# EAGLE design linistepper with aligned transistors_my_version4_powerfix (EAGLE 7.6.0)
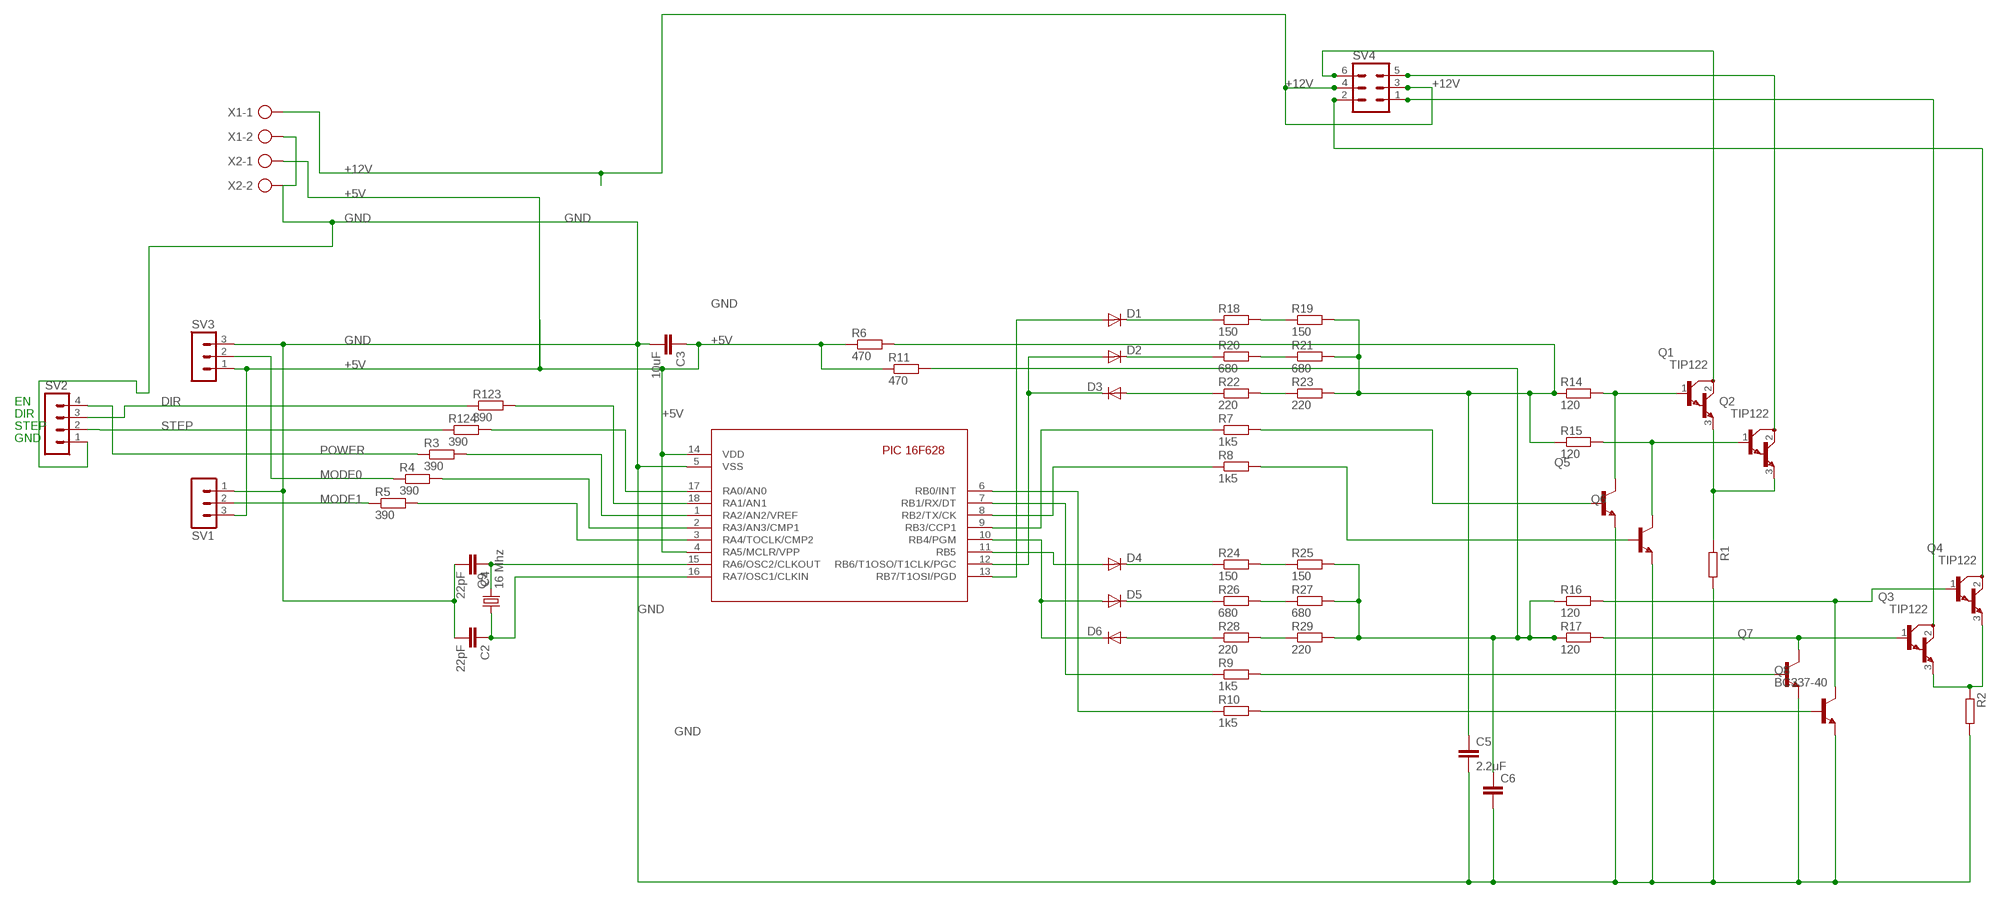
[diagram p0: schematic, sheet 1]

## Parts
C2  22pF  C-EU025-024X044  [C025-024X044]
C3  10uF  C-EU025-040X050  [C025-040X050]
C4  22pF  C-EU025-024X044  [C025-024X044]
C5  2.2uF  C-EU050-024X044  [C050-024X044]
C6  C-EU050-024X044  [C050-024X044]
D1  1N4148  [DO35-10]
D2  1N4148  [DO35-10]
D3  1N4148  [DO35-10]
D4  1N4148  [DO35-10]
D5  1N4148  [DO35-10]
D6  1N4148  [DO35-10]
Q1  TIP122  [TO220]
Q2  TIP122  [TO220]
Q3  TIP122  [TO220]
Q4  TIP122  [TO220]
Q5  BC337-40  [TO92]
Q6  BC337-40  [TO92]
Q7  BC337-40  [TO92]
Q8  BC337-40  [TO92]
Q9  16 Mhz  CRYTALHC49S  [HC49/S]
R1  R-EU_0922/22  [0922/22]
R2  R-EU_0922/22  [0922/22]
R3  390  R-EU_0207/2V  [0207/2V]
R4  390  R-EU_0411/3V  [0411V]
R5  390  R-EU_0207/5V  [0207/5V]
R6  470  R-EU_0207/10  [0207/10]
R7  1k5  R-EU_0207/10  [0207/10]
R8  1k5  R-EU_0207/7  [0207/7]
R9  1k5  R-EU_0207/5V  [0207/5V]
R10  1k5  R-EU_0207/5V  [0207/5V]
R11  470  R-EU_0207/7  [0207/7]
R14  120  R-EU_0207/10  [0207/10]
R15  120  R-EU_0207/7  [0207/7]
R16  120  R-EU_0207/5V  [0207/5V]
R17  120  R-EU_0207/5V  [0207/5V]
R18  150  R-EU_0207/2V  [0207/2V]
R19  150  R-EU_0207/2V  [0207/2V]
R20  680  R-EU_0207/2V  [0207/2V]
R21  680  R-EU_0207/2V  [0207/2V]
R22  220  R-EU_0207/2V  [0207/2V]
R23  220  R-EU_0207/2V  [0207/2V]
R24  150  R-EU_0207/2V  [0207/2V]
R25  150  R-EU_0207/2V  [0207/2V]
R26  680  R-EU_0207/2V  [0207/2V]
R27  680  R-EU_0207/2V  [0207/2V]
R28  220  R-EU_0207/2V  [0207/2V]
R29  220  R-EU_0207/2V  [0207/2V]
R123  390  R-EU_0207/2V  [0207/2V]
R124  390  R-EU_0207/2V  [0207/2V]
SV1  MA03-1  [MA03-1]
SV2  MA04-1  [MA04-1]
SV3  MA03-1  [MA03-1]
SV4  MA03-2  [MA03-2]
U$1  16F628  [PIC16F628-18-LEAD-PDIP]
X1  AK300/2  [AK300/2]
X2  AK300/2  [AK300/2]

## Nets
+5V: C3.1 R6.1 R11.1 SV1.3 SV3.1 U$1.4(RA5/MCLR/VPP) U$1.14(VDD) X2.1
+12V: SV4.3 SV4.4 X1.1
DIR: R123.1 SV2.3
GND: C2.2 C3.2 C4.2 C5.2 C6.2 Q5.1(E) Q6.1(E) Q7.1(E) Q8.1(E) R1.2 R2.2 SV1.1 SV2.1 SV3.3 U$1.5(VSS) X1.2 X2.2
MODE0: R4.1 SV3.2
MODE1: R5.1 SV1.2
N$1: R18.2 R19.1
N$2: C5.1 R6.2 R14.1 R15.1 R19.2 R21.2 R23.2
N$3: R20.2 R21.1
N$5: Q1.1(B) Q5.3(C) R14.2
N$6: Q2.1(B) Q6.3(C) R15.2
N$7: D1.C R18.1
N$8: D2.C R20.1
N$9: D3.A R22.1
N$10: D1.A U$1.13(RB7/T1OSI/PGD)
N$11: D2.A D3.C U$1.12(RB6/T1OSO/T1CLK/PGC)
N$12: R8.1 U$1.8(RB2/TX/CK)
N$13: R7.1 U$1.9(RB3/CCP1)
N$14: Q5.2(B) R7.2
N$15: Q6.2(B) R8.2
N$16: Q1.3(E) Q2.3(E) R1.1
N$17: R3.2 U$1.1(RA2/AN2/VREF)
N$18: R4.2 U$1.2(RA3/AN3/CMP1)
N$19: R24.2 R25.1
N$20: D5.C R26.1
N$21: R26.2 R27.1
N$22: D6.A R28.1
N$23: R28.2 R29.1
N$24: D4.A U$1.11(RB5)
N$25: D5.A D6.C U$1.10(RB4/PGM)
N$26: R9.1 U$1.7(RB1/RX/DT)
N$27: R10.1 U$1.6(RB0/INT)
N$28: C6.1 R11.2 R16.1 R17.1 R25.2 R27.2 R29.2
N$29: Q4.1(B) Q8.3(C) R16.2
N$30: Q8.2(B) R10.2
N$31: Q3.1(B) Q7.3(C) R17.2
N$32: Q7.2(B) R9.2
N$33: Q3.3(E) Q4.3(E) R2.1
N$34: Q1.2(C) SV4.6
N$35: Q2.2(C) SV4.5
N$36: Q3.2(C) SV4.1
N$37: Q4.2(C) SV4.2
N$39: R124.2 U$1.17(RA0/AN0)
N$41: R123.2 U$1.18(RA1/AN1)
N$43: C2.1 Q9.1 U$1.16(RA7/OSC1/CLKIN)
N$44: C4.1 Q9.2 U$1.15(RA6/OSC2/CLKOUT)
N$48: R5.2 U$1.3(RA4/TOCLK/CMP2)
POWER: R3.1 SV2.4
R23: R22.2 R23.1
R24: D4.C R24.1
STEP: R124.1 SV2.2

## Notes on the sheet
- EN
- DIR
- STEP
- GND

## Library data of the parts
C2-C6 = rcl:C-EU: CAPACITOR, European symbol
D1-D6 = diode:1N4148: DIODE high speed (Philips)
Q1-Q4 = transistor-npn_no_hole:TIP122*: NPN Darlington Transistor
Q5-Q8 = transistor-npn:BC337*: NPN Transistor
Q9 = crystal:CRYTAL: CRYSTAL
R1 R2 R5-R7 R14 R18-R29 R123 R124 = rcl:R-EU_: RESISTOR, European symbol
R3 R4 R8-R11 R15-R17 = resistor:R-EU_: RESISTOR, European symbol
SV1 SV3 = con-lstb:MA03-1: PIN HEADER
SV2 = con-lstb:MA04-1: PIN HEADER; OC_FARNELL: unknown; OC_NEWARK: unknown
SV4 = con-lstb:MA03-2: PIN HEADER
U$1 = pic16f6xx:16F628: Microchip component PIC 16F628 Eric Magraner - eric_magraner@yahoo.fr 03/2004
X1 X2 = con-ptr500:AK300/2: CONNECTOR; OC_FARNELL: unknown; OC_NEWARK: unknown

## Board
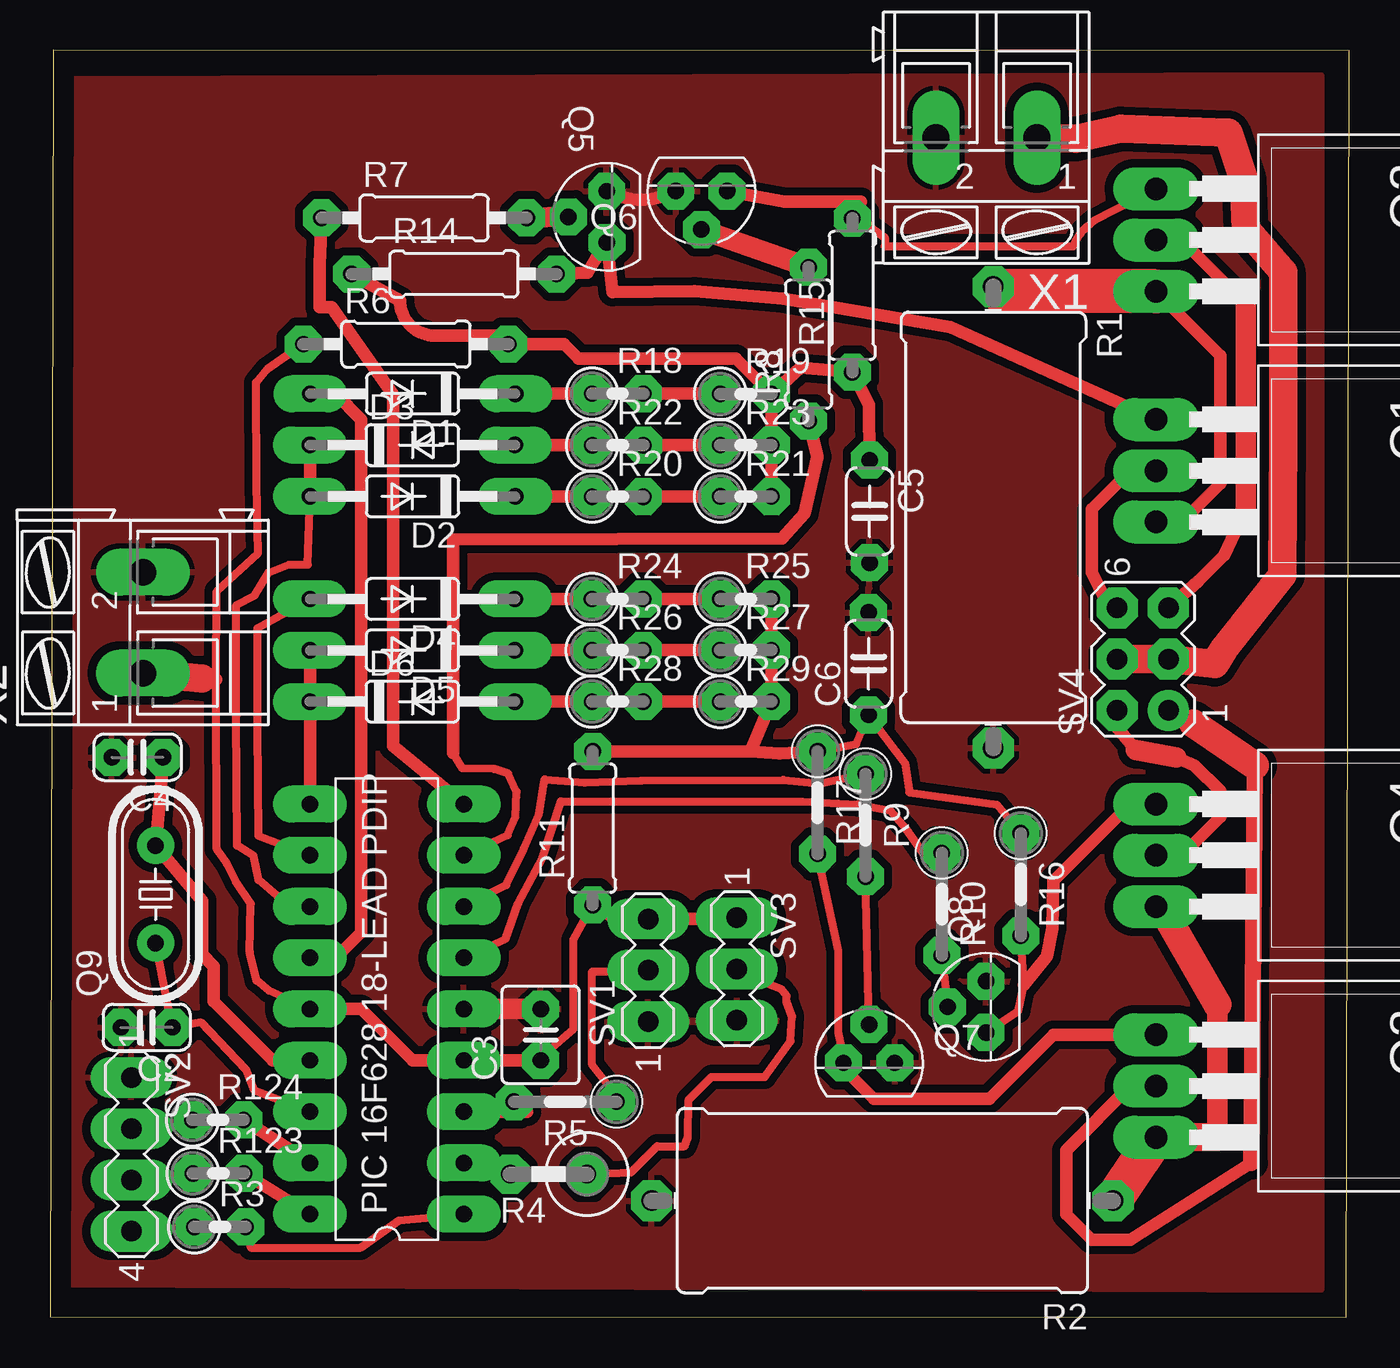
[diagram p1: board, top side]

Size 64.33 x 62.74 mm. Coordinates in mm from the lower left corner, seen from the top.
Outline: 0,0.02 64.19,0 64.33,62.72 0.14,62.74 0,0.02
Copper layers (1*16): Top 0.035mm / dielectric 1.5mm / Bottom 0.035mm
Design rules "default *": minimum track width 24mil, minimum drill 24mil, track to track 16mil, track to pad 15mil, pad to pad 8mil, via to via 8mil, smd to smd 8mil, copper to edge 40mil, drill to drill 8mil, minimum pad ring 20mil, minimum via ring 8mil, stop-mask expansion 4mil, vias tented up to drill 0mil, thermal gap 10mil

### Footprints (pad centres in the part's own frame; a part is rotated, then mirrored left to right if it is on the bottom)
C025-024X044 = drill 0.813 octagon: 1 -1.27,0; 2 1.27,0
C025-040X050 = drill 0.813 octagon: 1 -1.27,0; 2 1.27,0
C050-024X044 = drill 0.813 octagon: 1 -2.54,0; 2 2.54,0
DO35-10 = drill 0.813 long: A 5.08,0; C -5.08,0
TO220 = drill 1.118 long: 1 -2.54,-6.35; 2 0,-6.35; 3 2.54,-6.35
TO92 = drill 0.813 octagon: 1 1.27,0; 2 0,1.905; 3 -1.27,0
HC49/S = drill 0.813: 1 -2.413,0; 2 2.413,0
0922/22 = drill 1.016 octagon: 1 -11.43,0; 2 11.43,0
0207/2V = drill 0.813 octagon: 1 -1.27,0; 2 1.27,0
0411V = drill 0.914 octagon: 1 -2.54,0; 2 1.27,0
0207/5V = drill 0.813 octagon: 1 -2.54,0; 2 2.54,0
0207/10 = drill 0.813 octagon: 1 -5.08,0; 2 5.08,0
0207/7 = drill 0.813 octagon: 1 -3.81,0; 2 3.81,0
MA03-1 = drill 1.016 long: 1 -2.54,0; 2 0,0; 3 2.54,0
MA04-1 = drill 1.016 long: 1 -3.81,0; 2 -1.27,0; 3 1.27,0; 4 3.81,0
MA03-2 = drill 1.016: 1 -2.54,-1.27 | drill 1.016 octagon: 2 -2.54,1.27; 3 0,-1.27; 4 0,1.27; 5 2.54,-1.27; 6 2.54,1.27
PIC16F628-18-LEAD-PDIP = drill 0.813 long: 1 -10.16,-3.81; 2 -7.62,-3.81; 3 -5.08,-3.81; 4 -2.54,-3.81; 5 0,-3.81; 6 2.54,-3.81; 7 5.08,-3.81; 8 7.62,-3.81; 9 10.16,-3.81; 10 10.16,3.81; 11 7.62,3.81; 12 5.08,3.81; 13 2.54,3.81; 14 0,3.81; 15 -2.54,3.81; 16 -5.08,3.81; 17 -7.62,3.81; 18 -10.16,3.81
AK300/2 = drill 1.321 long: 1 -2.515,0; 2 2.489,0

### Placement (x,y rotation side)
C2  4.76,14.35 180 top
C3  24.28,13.98 90 top
C4  4.31,27.73 180 top
C5  40.58,39.91 270 top
C6  40.53,32.37 90 top
D1  17.94,45.73 180 top
D2  17.94,40.65 180 top
D3  17.93,43.2 0 top
D4  17.93,35.57 180 top
D5  17.93,33.02 180 top
D6  17.93,30.49 0 top
Q1  61.11,41.92 270 top
Q2  61.11,53.35 270 top
Q3  61.11,11.44 270 top
Q4  61.11,22.87 270 top
Q5  27.56,54.5 90.1 top
Q6  32.25,55.78 180 top
Q7  40.55,12.59 0 top
Q8  46.34,15.37 90 top
Q9  5.21,20.94 90 top
R1  46.71,39.62 270 top
R2  41.21,5.77 180 top
R3  8.4,4.46 0 top
R4  24.04,7.08 180 top
R5  25.5,10.66 180 top
R6  17.61,48.2 0 top
R7  18.51,54.45 0 top
R8  37.56,48.2 90 top
R9  40.37,24.36 270 top
R10  44.15,20.45 270 top
R11  26.86,24.22 90 top
R14  19.99,51.67 0 top
R15  39.72,50.61 90 top
R16  48.06,21.42 270 top
R17  38,25.48 270 top
R18  28.1,45.75 0 top
R19  34.44,45.73 0 top
R20  28.1,40.64 0 top
R21  34.45,40.65 0 top
R22  28.1,43.19 0 top
R23  34.44,43.2 0 top
R24  28.09,35.57 0 top
R25  34.45,35.58 0 top
R26  28.09,33.03 0 top
R27  34.44,33.04 0 top
R28  28.1,30.49 0 top
R29  34.45,30.49 0 top
R123  8.32,7.11 0 top
R124  8.3,9.76 0 top
SV1  29.61,17.17 90 top
SV2  4.01,8.06 270 top
SV3  34.01,17.24 270 top
SV4  54.12,32.59 90 top
U$1  16.66,15.25 90 top
X1  46.35,58.42 180 top
X2  4.58,34.41 90 top

### Tracks (layer width: path | path; a pad name or v marks a point on that pad's centre or on a via)
+5V
  Top 0.406: 24.48,12.71 24.48,13.03 25.91,14.27 25.91,18.7 R11.1 | R6.1 10.72,46.93 10.19,46.3 10.21,41.23 10.29,37.84 8.25,35.96 8.2,31.58 8.25,23.17 8.75,22.45 9.2,21.55 9.93,20.48 9.87,18.07 10.21,16.67 10.82,16.17 U$1.14
  Top 0.61: U$1.14 15.39,15.25 17.93,12.71 U$1.4 C3.1 24.48,12.71 | R11.1 28.09,19.66 SV1.3 34.2,19.71 SV3.1 | 7.5,31.64 8.2,31.58
  Top 1.422: X2.1 7.5,31.64
+12V
  Top 1.422: X1.1 50.79,58.37 53.02,58.86 58.35,58.66 59.12,56.33 59.22,53.91 61.07,51.77 61.07,43.57 61.03,36.77 58.15,33.13 57.67,32.35 SV4.3 SV4.4
DIR
  Top 0.406: SV2.3 R123.1
GND
  Top 0.61: Q5.1 arc56 Q6.1
  Top 1.016: C3.2 U$1.5
  pour Top (isolate 0.406): 0.64,61.33 62.95,61.54 62.95,1.33 0.54,1.59
MODE0
  Top 0.406: R4.1 28.75,7.17 30.05,8.46 31.41,8.46 31.58,8.92 31.61,10.76 32.74,11.89 35.38,11.89 36.67,13.68 36.74,14.89 36.47,15.63 36.47,15.9 36.2,16.25 34.25,16.99 SV3.2
MODE1
  Top 0.406: R5.1 27.67,11.42 26.83,12.49 26.83,17.12 27.16,17.12 27.77,17.12 27.95,17.3 29.48,17.3 SV1.2
N$1
  Top 0.254: R19.1
  Top 0.61: R19.1 R18.2
N$2
  Top 0.61: R14.1 17.31,50.35 arc90 19.05,48.61 22.54,48.61 arc90 R6.2 25.44,48.2 26.16,47.48 33.96,47.48 R19.2 | R19.2 37.15,47.04 R15.1 40.56,45.21 C5.1 | R19.2 R23.2 R21.2
N$3
  Top 0.254: R21.1
  Top 0.61: R20.2 R21.1
N$4
  Top 0.406: 48.36,18.8 48.36,18.87
N$5
  Top 0.61: R14.2 26.61,51.75 27.01,52.41 Q5.3 27.85,50.77 31.9,50.81 36.28,50.44 44.58,49.03 Q1.1
N$6
  Top 0.406: 40.41,54.14 41.33,53.47 41.33,53.04 50.67,53.04 arc-33 51.72,54.33 Q2.1
  Top 0.61: Q6.3 36.35,55.26 40.16,55.26 R15.2 40.41,54.14
N$7
  Top 0.61: D1.C 24.28,45.73 25.55,45.73 R18.1
N$8
  Top 0.61: D2.C 24.28,40.65 25.55,40.65 R20.1
N$9
  Top 0.61: R22.1 25.55,43.19 24.28,43.19 D3.A
N$10
  Top 0.61: U$1.13 14.12,17.79 15.39,19.06 15.39,44.46 14.12,45.73 D1.A
N$11
  Top 0.254: D2.A
  Top 0.406: U$1.12 11.22,20.86 10.31,21.64 10.05,22.84 9.24,23.36 9.21,29.82 9.21,35.26 10.12,35.75 10.8,36.88 11.8,37.27 12.74,37.27 D2.A
  Top 0.61: D2.A 12.85,41.92 D3.C
N$12
  Top 0.406: U$1.8 22.64,23.87 23.03,24.78 23.1,26.01 22.68,26.92 22,27.15 20.41,27.18 19.94,27.95
  Top 0.61: R8.1 38,42.62 37.35,39.81 36.25,38.57 19.94,38.52 19.94,27.95
N$13
  Top 0.61: U$1.9 16.97,28.28 16.97,45.71 13.93,50.04 13.32,50.04 13.32,52.15 R7.1
N$14
  Top 1.016: R7.2 Q5.2
N$15
  Top 1.016: R8.2 Q6.2
N$16
  Top 0.61: 47.14,50.81 R1.1 | Q1.3 56.03,39.38 57.94,41.29 57.94,47.64 Q2.3
  Top 2.184: Q2.3 47.14,50.81
N$17
  Top 0.406: R3.2 9.92,3.43 15.36,3.43 17.27,4.78 U$1.1
N$18
  Top 0.61: U$1.2 21.75,7.63 R4.2
N$19
  Top 0.254: R25.1
  Top 0.61: R24.2 R25.1
N$20
  Top 0.61: D5.C 24.28,33.03 25.55,33.03 R26.1
N$21
  Top 0.254: R27.1
  Top 0.61: R26.2 R27.1
N$22
  Top 0.61: D6.A 24.28,30.49 25.55,30.49 R28.1
N$23
  Top 0.254: R29.1
  Top 0.61: R28.2 R29.1
N$24
  Top 0.406: U$1.11 10.3,23.84 10.25,29.12 10.25,34.12 D4.A
N$25
  Top 0.254: D5.A | D6.C
  Top 0.61: U$1.10 D6.C D5.A
N$26
  Top 0.406: U$1.7 22.58,21.41 23.46,23.23 24.2,24.9 24.48,26.63 26.47,26.48 29.26,26.58 36.31,26.62 38.1,26.43 R9.1
N$27
  Top 0.406: U$1.6 22.55,18.74 23.17,20.49 24.37,22.76 25.29,25.55 37.24,25.54 40,25.4 41.58,25.1 42.39,24.18 43.22,23 R10.1
N$28
  Top 0.254: R25.2 | R29.2
  Top 0.406: R17.1 39.92,28.38 C6.1 42.32,27.46 42.54,26 46.87,25.39 R16.1
  Top 0.61: R25.2 R27.2 R29.2 34.68,28.03 | R11.2 34.68,28.03 | 34.68,28.03 36.11,27.91 R17.1
N$29
  Top 0.406: Q8.3 47.94,15.15 48.21,16.46 R16.2
  Top 0.61: Q4.1 53.49,25.41 49.68,21.6 49.63,19.25 49.37,17.87 48.21,16.46
N$30
  Top 0.406: R10.2 Q8.2
N$31
  Top 0.406: Q7.3 39.21,13.29 39.03,14.1 39.03,18.15 R17.2
  Top 0.61: Q3.1 49.68,13.98 46.51,10.81 40.79,10.81 39.52,12.08 Q7.3
N$32
  Top 0.406: Q7.2 R9.2
N$33
  Top 1.016: 57.81,8.93 57.81,15.49
  Top 1.422: Q3.3 57.81,8.93 | 57.81,15.49 55.23,19.98 Q4.3
  Top 1.93: R2.1 Q3.3
N$34
  Top 0.61: Q1.2 53.49,41.92 51.59,40.02 51.59,38.75 51.59,36.88 52.26,35.54 SV4.6
N$35
  Top 0.61: 59.21,40.02 58.15,37.75 56.85,36.45 SV4.5 | 59.21,50.18 56.03,53.35 Q2.2
  Top 1.016: 59.21,50.18 59.21,40.02
N$36
  Top 0.61: 59.49,7.63 53.49,3.82 51.59,3.82 50.32,5.09 50.32,8.27 53.49,11.44 Q3.2 | 56.61,29.41 SV4.1
  Top 0.813: 59.49,7.63 59.66,27.32
  Top 1.422: 59.66,27.32 56.61,29.41
N$37
  Top 0.61: 53.77,28.09 52.87,29.15 SV4.2 | 55.77,27.72 56.67,27.32 57.94,26.05 57.94,24.78 56.03,22.87 Q4.2
  Top 1.016: 55.77,27.72 53.77,28.09
N$39
  Top 0.61: R124.2 U$1.17
N$41
  Top 0.61: R123.2 U$1.18
N$43
  Top 0.406: U$1.16 10.09,11.23 9.7,12.24 7.46,14.59 C2.1 Q9.1
N$44
  Top 0.61: C4.1 5.36,24.98 Q9.2 7.51,20.62 7.51,17.96 8.1,17.37 8.1,15.63 11.01,12.71 U$1.15
N$48
  Top 0.61: U$1.3 23.61,10.17 arc-90 R5.2
POWER
  Top 0.406: SV2.4 R3.1
R23
  Top 0.254: R23.1
  Top 0.61: R22.2 R23.1
R24
  Top 0.61: D4.C 24.28,35.57 25.55,35.57 R24.1
STEP
  Top 0.406: SV2.2 R124.1